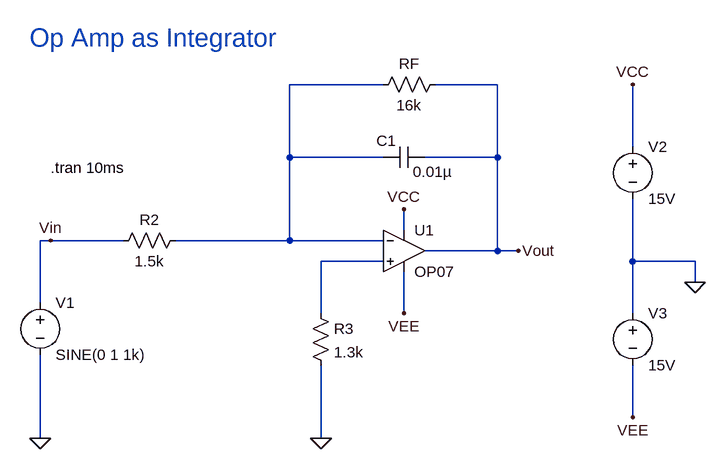
[diagram p0: schematic Op_Amp_Integrator.asc]
Op_Amp_Integrator.asc, the LTspice schematic file:
Version 4
SHEET 1 880 680
WIRE 96 -144 -48 -144
WIRE 272 -144 176 -144
WIRE 480 -48 480 -144
WIRE -48 -32 -48 -144
WIRE 96 -32 -48 -32
WIRE 272 -32 272 -144
WIRE 272 -32 160 -32
WIRE 128 80 128 48
WIRE -416 96 -432 96
WIRE -304 96 -416 96
WIRE -48 96 -48 -32
WIRE -48 96 -224 96
WIRE 96 96 -48 96
WIRE 272 112 272 -32
WIRE 272 112 160 112
WIRE 304 112 272 112
WIRE 96 128 0 128
WIRE 480 128 480 32
WIRE 576 128 480 128
WIRE 576 160 576 128
WIRE -432 192 -432 96
WIRE 0 208 0 128
WIRE 128 208 128 144
WIRE 480 208 480 128
WIRE 480 368 480 288
WIRE -432 400 -432 272
WIRE 0 400 0 288
FLAG 0 400 0
FLAG -432 400 0
FLAG 576 160 0
FLAG 304 112 Vout
FLAG 480 -144 VCC
FLAG 480 368 VEE
FLAG 128 208 VEE
FLAG 128 48 VCC
FLAG -416 96 Vin
SYMBOL OpAmps\\OP07 128 48 R0
SYMATTR InstName U1
SYMBOL cap 160 -48 R90
WINDOW 0 6 59 VBottom 2
WINDOW 3 23 -12 VTop 2
SYMATTR InstName C1
SYMATTR Value 0.01µ
SYMBOL res 192 -160 R90
WINDOW 0 0 56 VBottom 2
WINDOW 3 32 56 VTop 2
SYMATTR InstName RF
SYMATTR Value 16k
SYMBOL res -208 80 R90
WINDOW 0 0 56 VBottom 2
WINDOW 3 32 56 VTop 2
SYMATTR InstName R2
SYMATTR Value 1.5k
SYMBOL voltage -432 176 R0
WINDOW 123 0 0 Left 0
WINDOW 39 0 0 Left 0
SYMATTR InstName V1
SYMATTR Value SINE(0 1 1k)
SYMBOL voltage 480 -64 R0
WINDOW 123 0 0 Left 0
WINDOW 39 0 0 Left 0
SYMATTR InstName V2
SYMATTR Value 15V
SYMBOL voltage 480 192 R0
WINDOW 123 0 0 Left 0
WINDOW 39 0 0 Left 0
SYMATTR InstName V3
SYMATTR Value 15V
SYMBOL res -16 192 R0
SYMATTR InstName R3
SYMATTR Value 1.3k
TEXT -416 -16 Left 2 !.tran 10ms
TEXT -448 -216 Left 4 ;Op Amp as Integrator

The netlist it stands for:
* Op_Amp_Integrator.asc
XU1 N002 N001 VCC VEE Vout LT1001  ; OP07, pins In+ In- V+ V- OUT
C1 Vout N001 0.01µ
RF Vout N001 16k
R2 N001 Vin 1.5k
V1 Vin 0 SINE(0 1 1k)
V2 VCC 0 15V
V3 0 VEE 15V
R3 N002 0 1.3k
.tran 10ms
* Op Amp as Integrator
.lib LTC.lib
.backanno
.end